# Altium schematic sheet Memory.SchDoc
size A4; SheetNumber: 6; SheetTotal: 15
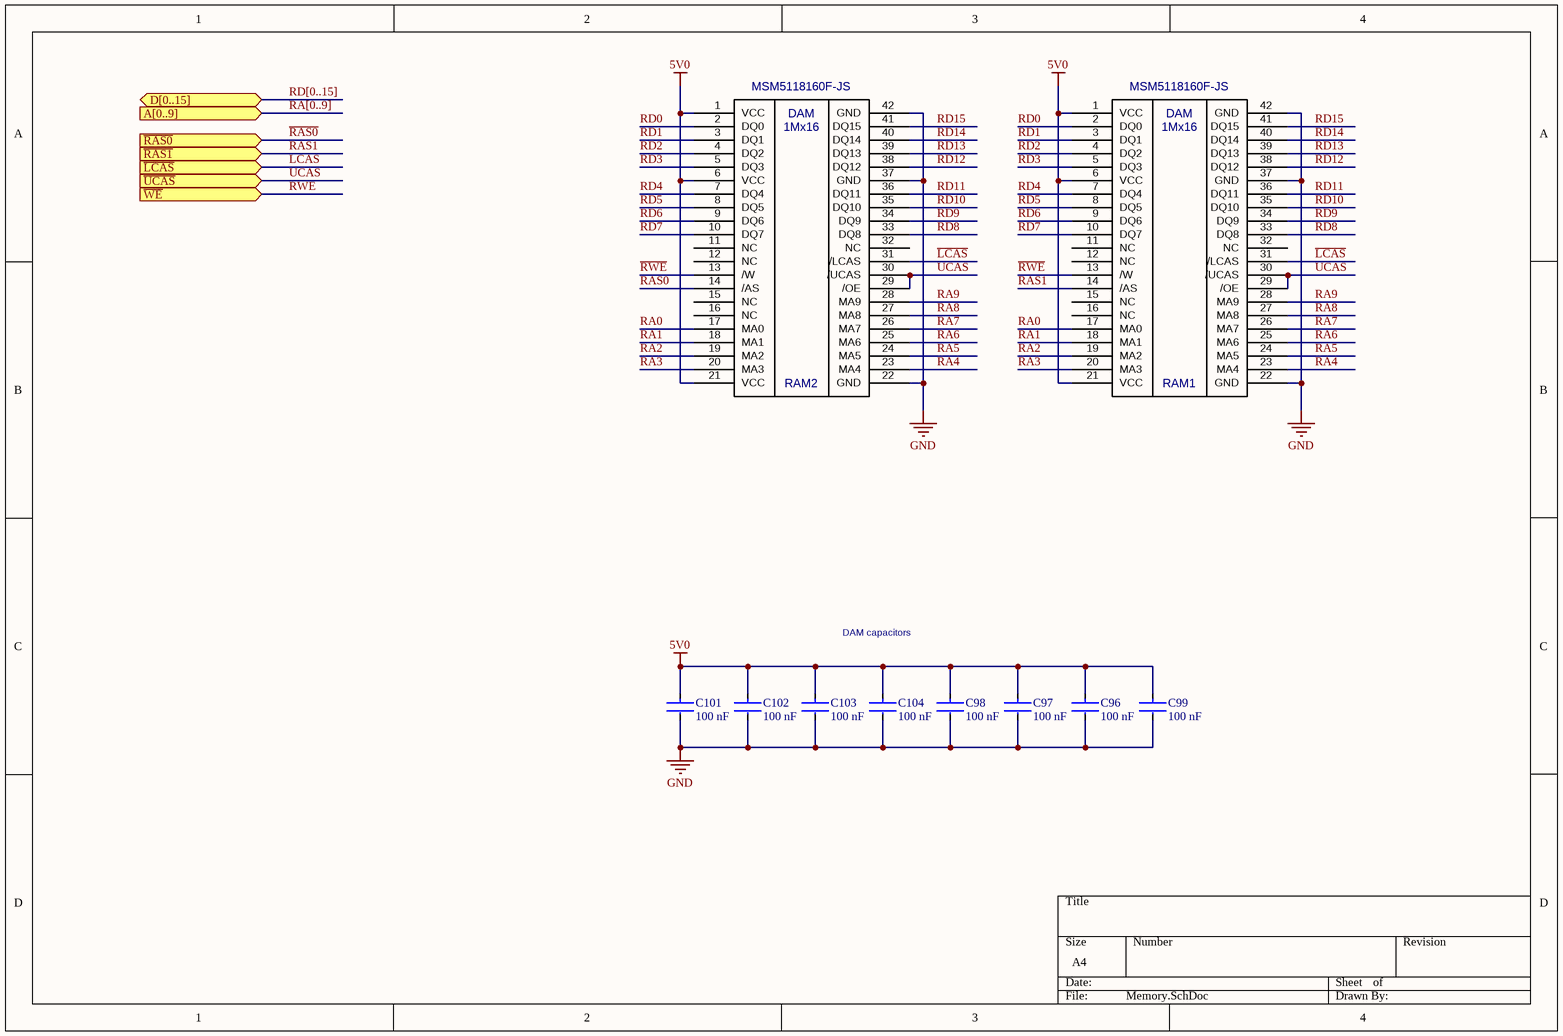
[diagram p0: Memory.SchDoc]

## Parts
C96  Capacitance: 100 nF  [FP-CC0805-0_85-IPC_A]  (hidden comment: CC0805KRX7R9BB104)
C97  Capacitance: 100 nF  [FP-CC0805-0_85-IPC_A]  (hidden comment: CC0805KRX7R9BB104)
C98  Capacitance: 100 nF  [FP-CC0805-0_85-IPC_A]  (hidden comment: CC0805KRX7R9BB104)
C99  Capacitance: 100 nF  [FP-CC0805-0_85-IPC_A]  (hidden comment: CC0805KRX7R9BB104)
C101  Capacitance: 100 nF  [FP-CC0805-0_85-IPC_A]  (hidden comment: CC0805KRX7R9BB104)
C102  Capacitance: 100 nF  [FP-CC0805-0_85-IPC_A]  (hidden comment: CC0805KRX7R9BB104)
C103  Capacitance: 100 nF  [FP-CC0805-0_85-IPC_A]  (hidden comment: CC0805KRX7R9BB104)
C104  Capacitance: 100 nF  [FP-CC0805-0_85-IPC_A]  (hidden comment: CC0805KRX7R9BB104)
RAM1  MSM5118160F-JS  [SOJ42]
RAM2  MSM5118160F-JS  [SOJ42]

## Ports
A[0..9] (in), D[0..15] (bidir), ~{LCAS} (in), ~{RAS0} (in), ~{RAS1} (in), ~{UCAS} (in), ~{WE} (in)

## Nets
5V0: C96.1 C97.1 C98.1 C99.1 C101.1 C102.1 C103.1 C104.1 RAM1.1(VCC) RAM1.6(VCC) RAM1.21(VCC) RAM2.1(VCC) RAM2.6(VCC) RAM2.21(VCC)
GND: C96.2 C97.2 C98.2 C99.2 C101.2 C102.2 C103.2 C104.2 RAM1.22(GND) RAM1.37(GND) RAM1.42(GND) RAM2.22(GND) RAM2.37(GND) RAM2.42(GND)
~{LCAS}: RAM1.31(/LCAS) RAM2.31(/LCAS) ; port ~{LCAS}
~{RAS0}: RAM2.14(/AS) ; port ~{RAS0}
~{RAS1}: RAM1.14(/AS) ; port ~{RAS1}
~{RWE}: RAM1.13(/W) RAM2.13(/W) ; port ~{WE}
RA0: RAM1.17(MA0) RAM2.17(MA0)
RA1: RAM1.18(MA1) RAM2.18(MA1)
RA2: RAM1.19(MA2) RAM2.19(MA2)
RA3: RAM1.20(MA3) RAM2.20(MA3)
RA4: RAM1.23(MA4) RAM2.23(MA4)
RA5: RAM1.24(MA5) RAM2.24(MA5)
RA6: RAM1.25(MA6) RAM2.25(MA6)
RA7: RAM1.26(MA7) RAM2.26(MA7)
RA8: RAM1.27(MA8) RAM2.27(MA8)
RA9: RAM1.28(MA9) RAM2.28(MA9)
RD0: RAM1.2(DQ0) RAM2.2(DQ0)
RD1: RAM1.3(DQ1) RAM2.3(DQ1)
RD2: RAM1.4(DQ2) RAM2.4(DQ2)
RD3: RAM1.5(DQ3) RAM2.5(DQ3)
RD4: RAM1.7(DQ4) RAM2.7(DQ4)
RD5: RAM1.8(DQ5) RAM2.8(DQ5)
RD6: RAM1.9(DQ6) RAM2.9(DQ6)
RD7: RAM1.10(DQ7) RAM2.10(DQ7)
RD8: RAM1.33(DQ8) RAM2.33(DQ8)
RD9: RAM1.34(DQ9) RAM2.34(DQ9)
RD10: RAM1.35(DQ10) RAM2.35(DQ10)
RD11: RAM1.36(DQ11) RAM2.36(DQ11)
RD12: RAM1.38(DQ12) RAM2.38(DQ12)
RD13: RAM1.39(DQ13) RAM2.39(DQ13)
RD14: RAM1.40(DQ14) RAM2.40(DQ14)
RD15: RAM1.41(DQ15) RAM2.41(DQ15)
~{UCAS}: RAM1.29(/OE) RAM1.30(/UCAS) RAM2.29(/OE) RAM2.30(/UCAS) ; port ~{UCAS}

Not connected (* = marked no-connect by the designer): RAM1 11(NC) 12(NC) 15(NC) 16(NC) 32(NC); RAM2 11(NC) 12(NC) 15(NC) 16(NC) 32(NC)

## Buses and harness runs
bus RA[0..9] = port A[0..9]
bus RD[0..15] = port D[0..15]

## Notes on the sheet
- DAM capacitors
- (in symbol MSM5118160F-JS) DAM; 1Mx16

## Library data of the parts
C96-C99 C101-C104 = CMP-2100-03606-3: CAP CER 0.1UF 50V X7R 0805; Manufacturer: Yageo; Value: 100 nF; Manufacturer Part Number: CC0805KRX7R9BB104; Category: Cap; Case/Package: 0805
RAM1 RAM2 = MSM5118160F-JS: Value: MSM5118160F-JS; Case/Package: SOJ-42; Category: IC